# Altium schematic sheet 03_USB_JTAG.SchDoc
size A
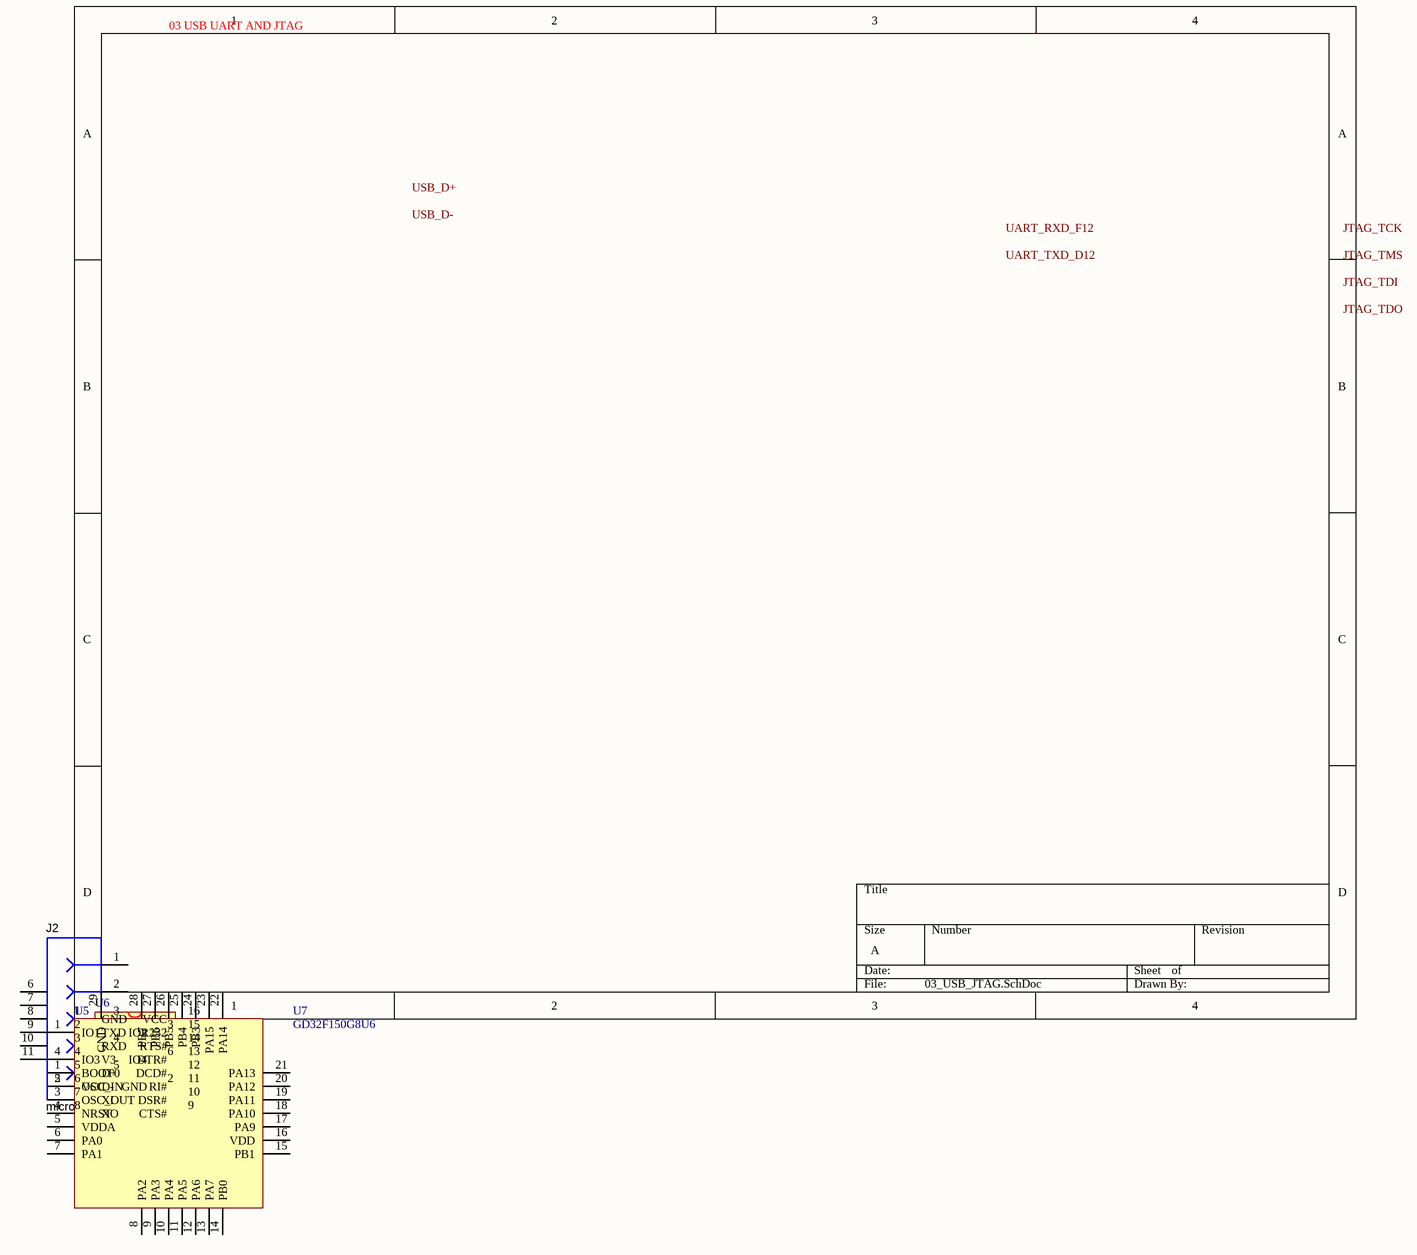
[diagram p0: 03_USB_JTAG.SchDoc]

## Parts
J2  micro-usb-sj20  [YQMICRO-USB-SJ20]
U5  SRV05-4  [DBV0006A_N]
U6  CH340G  [SOP16M]
U7  GD32F150G8U6  [WQFN-28_L4.0-W4.0-P0.40-BL-EP]

## Nets
NetU5_5: U5.5(VCC) U7.2(OSC_IN)

Not connected (* = marked no-connect by the designer): J2 1 2 3 4 5 6 7 8 9 10 11; U5 1(IO1) 2(GND) 3(IO2) 4(IO3) 6(IO4); U6 1(GND) 2(TXD) 3(RXD) 4(V3) 5(D+) 6(D-) 7(XI) 8(XO) 9(CTS#) 10(DSR#) 11(RI#) 12(DCD#) 13(DTR#) 14(RTS#) 15(R232) 16(VCC); U7 1(BOOT0) 3(OSC_OUT) 4(NRST) 5(VDDA) 6(PA0) 7(PA1) 8(PA2) 9(PA3) 10(PA4) 11(PA5) 12(PA6) 13(PA7) 14(PB0) 15(PB1) 16(VDD) 17(PA9) 18(PA10) 19(PA11) 20(PA12) 21(PA13) 22(PA14) 23(PA15) 24(PB3) 25(PB4) 26(PB5) 27(PB6) 28(PB7) 29(GND)

## Notes on the sheet
- 03 USB UART AND JTAG
- Labels drawn without touching a wire or pin: JTAG_TCK, JTAG_TDI, JTAG_TDO, JTAG_TMS, UART_RXD_F12, UART_TXD_D12, USB_D+, USB_D-

## Library data of the parts
J2 = 105017-0001: Receptacle, Micro-USB-B, Right Angle, SMD; Manufacturer: Molex; SymbolCreator: a0412235; CompType: Connector; U/M: EA; SymbolVersion: 2012-12-19; PartNumber: micro-usb-sj20; RoHS: Y; PackageReference: Micro USB receptacle; MountType: SMT; ComponentLink1Description: Datasheet Link; ComponentLink1URL: http://www.molex.com/pdm_docs/sd/1050170001_sd.pdf; Publisher: Texas Instruments; LatestRevisionDate: 2012-12-26; LatestRevisionNote: Added parts, moved some to Hardware.IntLib; Supplier 1: Digi-Key; Supplier Part Number 1: WM1399CT-ND; Supplier 2: Mouser; Supplier Part Number 2: 538-105017-0001; Supplier 3: Farnell; Supplier Part Number 3: 1847433
U5 = TPD4E001DBVR: Low-Capacitance + / - 15-kV ESD Protection Array for High-Speed Data Interfaces, 4 Channels, -40 to +85 degC, 6-pin SOT-23 (DBV), Green (RoHS & no Sb/Br); Manufacturer: Texas Instruments; Alternate Manufacturer: None; Alternate PartNumber: Equivalent; 1394 / Firewire: TRUE; Breakdown Voltage(Min)(V): 11; IEC 61000-4-2 Air-Gap(+/- kV): 15; IEC 61000-4-2 Contact(+/- kV): 8; IO Capacitance(Typ)(pF): 1.5; SubFamily: ESD Solution; DatasheetVersion: SLLS682G; PackageVersion: revK, Mar-2006; PackageReference: DBV0006A; PackageDescription: 6-Pin Plastic Small-Outline Package, 2.9 x 1.6 mm Body, 0.95 mm Pitch, 2.8 mm Lead Span; Supplier 1: Digi-Key; Supplier Part Number 1: 296-28203-2-ND; Supplier 2: Digi-Key; Supplier Part Number 2: 296-28203-1-ND; Supplier 3: Digi-Key; Supplier Part Number 3: 296-28203-6-ND; Supplier 4: Newark; Supplier Part Number 4: 27T6836; Supplier 5: Mouser; Supplier Part Number 5: 595-TPD4E001DBVR; Eco-Plan: Green (RoHS & no Sb/Br); IO Leakage Current(nA): 1.5; Serial ATA / eSATA: TRUE; USB High Speed: TRUE; MountType: SMT; Code_JEDEC: MO-178-AB*; PartNumber: TPD4E001DBVR; ComponentLink1Description: Datasheet; ComponentLink1URL: http://www.ti.com/general/docs/lit/getliterature.tsp?genericPartNumber=TPD4E001&fileType=pdf; ComponentLink2Description: URL Link1; ComponentLink2URL: SamplesURL:http://www.ti.com/product/tpd4e001#samples
U6 = CH340G: USB2UART
U7 = GD32F150U: ComponentLink1Description: Manufacturer URL; ComponentLink1URL: http://www.ti.com/; ComponentLink2Description: Datasheet; ComponentLink2URL: http://www.ti.com/general/docs/lit/getliterature.tsp?genericPartNumber=DAC904&fileType=pdf; ComponentLink3Description: Package Specification; ComponentLink3URL: http://www.ti.com/litv/pdf/mpds364